# EAGLE design Power_Block (EAGLE 5.06)
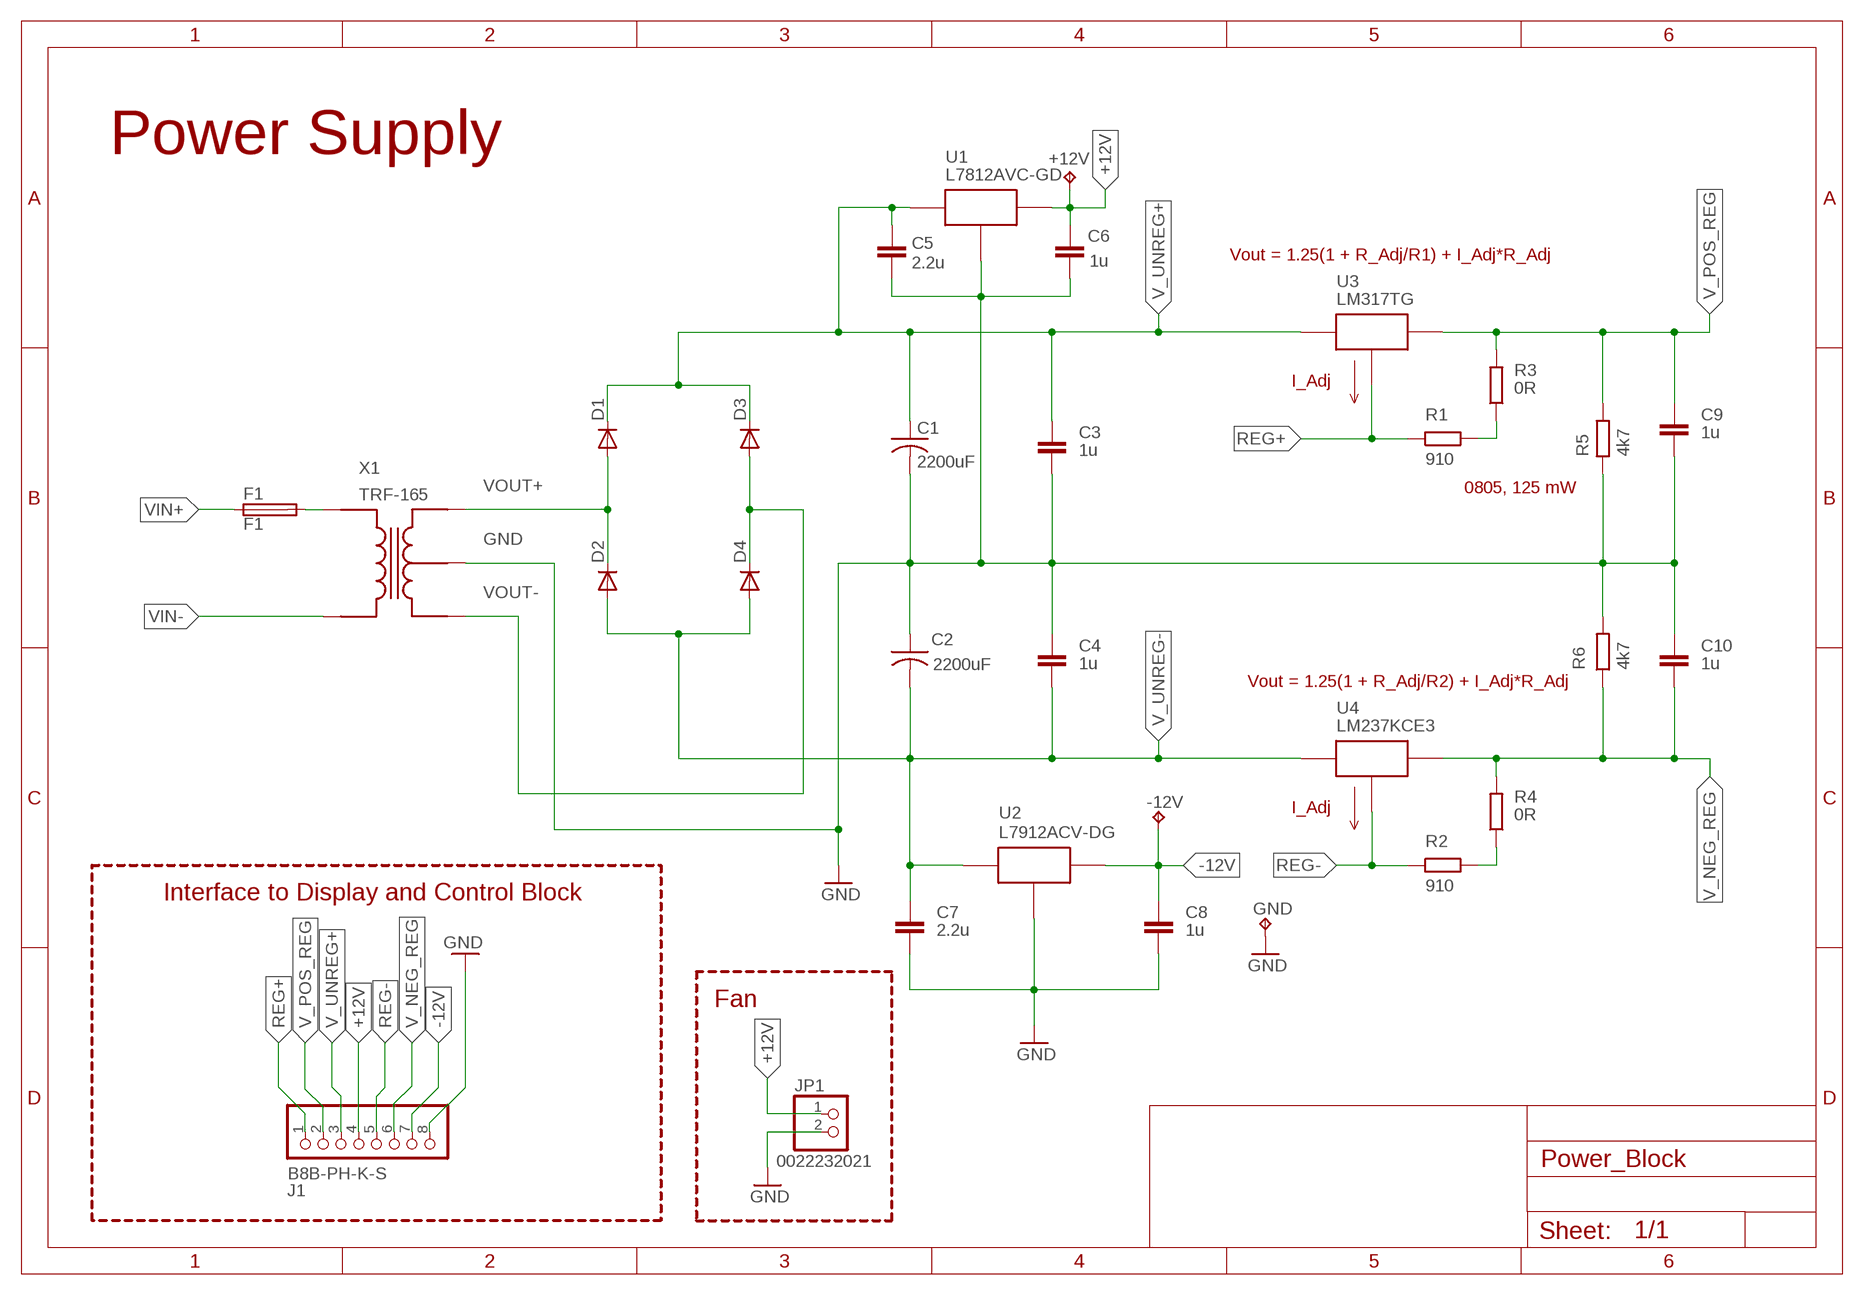
[diagram p0: schematic, sheet 1]

## Parts
+12V  TPTP20SQ  [TP20SQ]
-12V  TPTP20SQ  [TP20SQ]
C1  2200uF  ESK228M  [ESK228M]
C2  2200uF  ESK228M  [ESK228M]
C3  1u  C-EU025-024X044  [C025-024X044]
C4  1u  C-EU025-024X044  [C025-024X044]
C5  2.2u  C-EU025-024X044  [C025-024X044]
C6  1u  C-EU025-024X044  [C025-024X044]
C7  2.2u  C-EU025-024X044  [C025-024X044]
C8  1u  C-EU025-024X044  [C025-024X044]
C9  1u  C-EU025-024X044  [C025-024X044]
C10  1u  C-EU025-024X044  [C025-024X044]
D1  VS-2EFH02HM3/I  [DO-219AB]
D2  VS-2EFH02HM3/I  [DO-219AB]
D3  VS-2EFH02HM3/I  [DO-219AB]
D4  VS-2EFH02HM3/I  [DO-219AB]
F1  F1  SH22,5  [SH22,5]
GND  TPTP20SQ  [TP20SQ]
J1  B8B-PH-K-S  [B8B-PH-K-S]
JP1  0022232021  PINHD-1X2  [1X02]
R1  910  R-EU_R0603  [R0603]
R2  910  R-EU_R0603  [R0603]
R3  0R  R-EU_R0603  [R0603]
R4  0R  R-EU_R0603  [R0603]
R5  4k7  R-EU_M0805  [M0805]
R6  4k7  R-EU_M0805  [M0805]
U1  L7812AVC-GD  [T0-220]
U2  L7912ACV-DG  [T0-220]
U3  LM317TG  [T0-220]
U4  LM237KCE3  [T0-220]
X1  TRF-165  [TRF-165]

## Nets
+12V: +12V.TP C6.2 J1.4 JP1.1 U1.P3
-12V: -12V.TP C8.2 J1.7 U2.P3
GND: C1.LL- C2.LL+ C3.1 C4.2 C5.1 C6.1 C7.1 C8.1 C9.1 C10.2 GND.TP J1.8 JP1.2 R5.1 R6.2 U1.P2 U2.P1 X1.GND
N$15: R2.2 R4.1
N$17: R1.2 R3.1
REG+: J1.1 R1.1 U3.P1
REG-: J1.5 R2.1 U4.P1
V_NEG_REG: C10.1 J1.6 R4.2 R6.1 U4.P3
V_POS_REG: C9.2 J1.2 R3.2 R5.2 U3.P2
V_UNREG+: C1.LL+ C3.2 C5.2 D1.C D3.C J1.3 U1.P1 U3.P3
V_UNREG-: C2.LL- C4.1 C7.2 D2.A D4.A U2.P2 U4.P2
VIN+: F1.1
VIN+_F1: F1.2 X1.VIN1
VIN-: X1.VIN2
VOUT+: D1.A D2.C X1.VOUT+
VOUT-: D3.A D4.C X1.VOUT-

## Notes on the sheet
- Power Supply
- Vout = 1.25(1 + R_Adj/R1) + I_Adj*R_Adj
- I_Adj
- 0805, 125 mW
- Vout = 1.25(1 + R_Adj/R2) + I_Adj*R_Adj
- I_Adj
- Interface to Display and Control Block
- Fan

## Library data of the parts
+12V -12V GND = testpad:TP: Test pad
C1 C2 = VladimirG:ESK228M
C3-C10 = rcl:C-EU: CAPACITOR, European symbol
D1-D4 = VladimirG:VS-2EFH02HM3/I
F1 = fuse:SH22,5: FUSE HOLDER grid 22,5 mm, OGN0031 8201, Schurter (Buerklin)
J1 = VladimirG:B8B-PH-K-S: CONN HEADER VERT 8POS 2MM
JP1 = pinhead:PINHD-1X2: PIN HEADER
R1-R4 = rcl:R-EU_: RESISTOR, European symbol
R5 R6 = resistor:R-EU_: RESISTOR, European symbol
U1 = VladimirG:L7812AVC-GD: IC REG LINEAR 12V 1.5A TO220AB
U2 = VladimirG:L7912ACV-DG
U3 = VladimirG:LM317TG
U4 = VladimirG:LM237KCE3
X1 = VladimirG:TRF-165

## Board
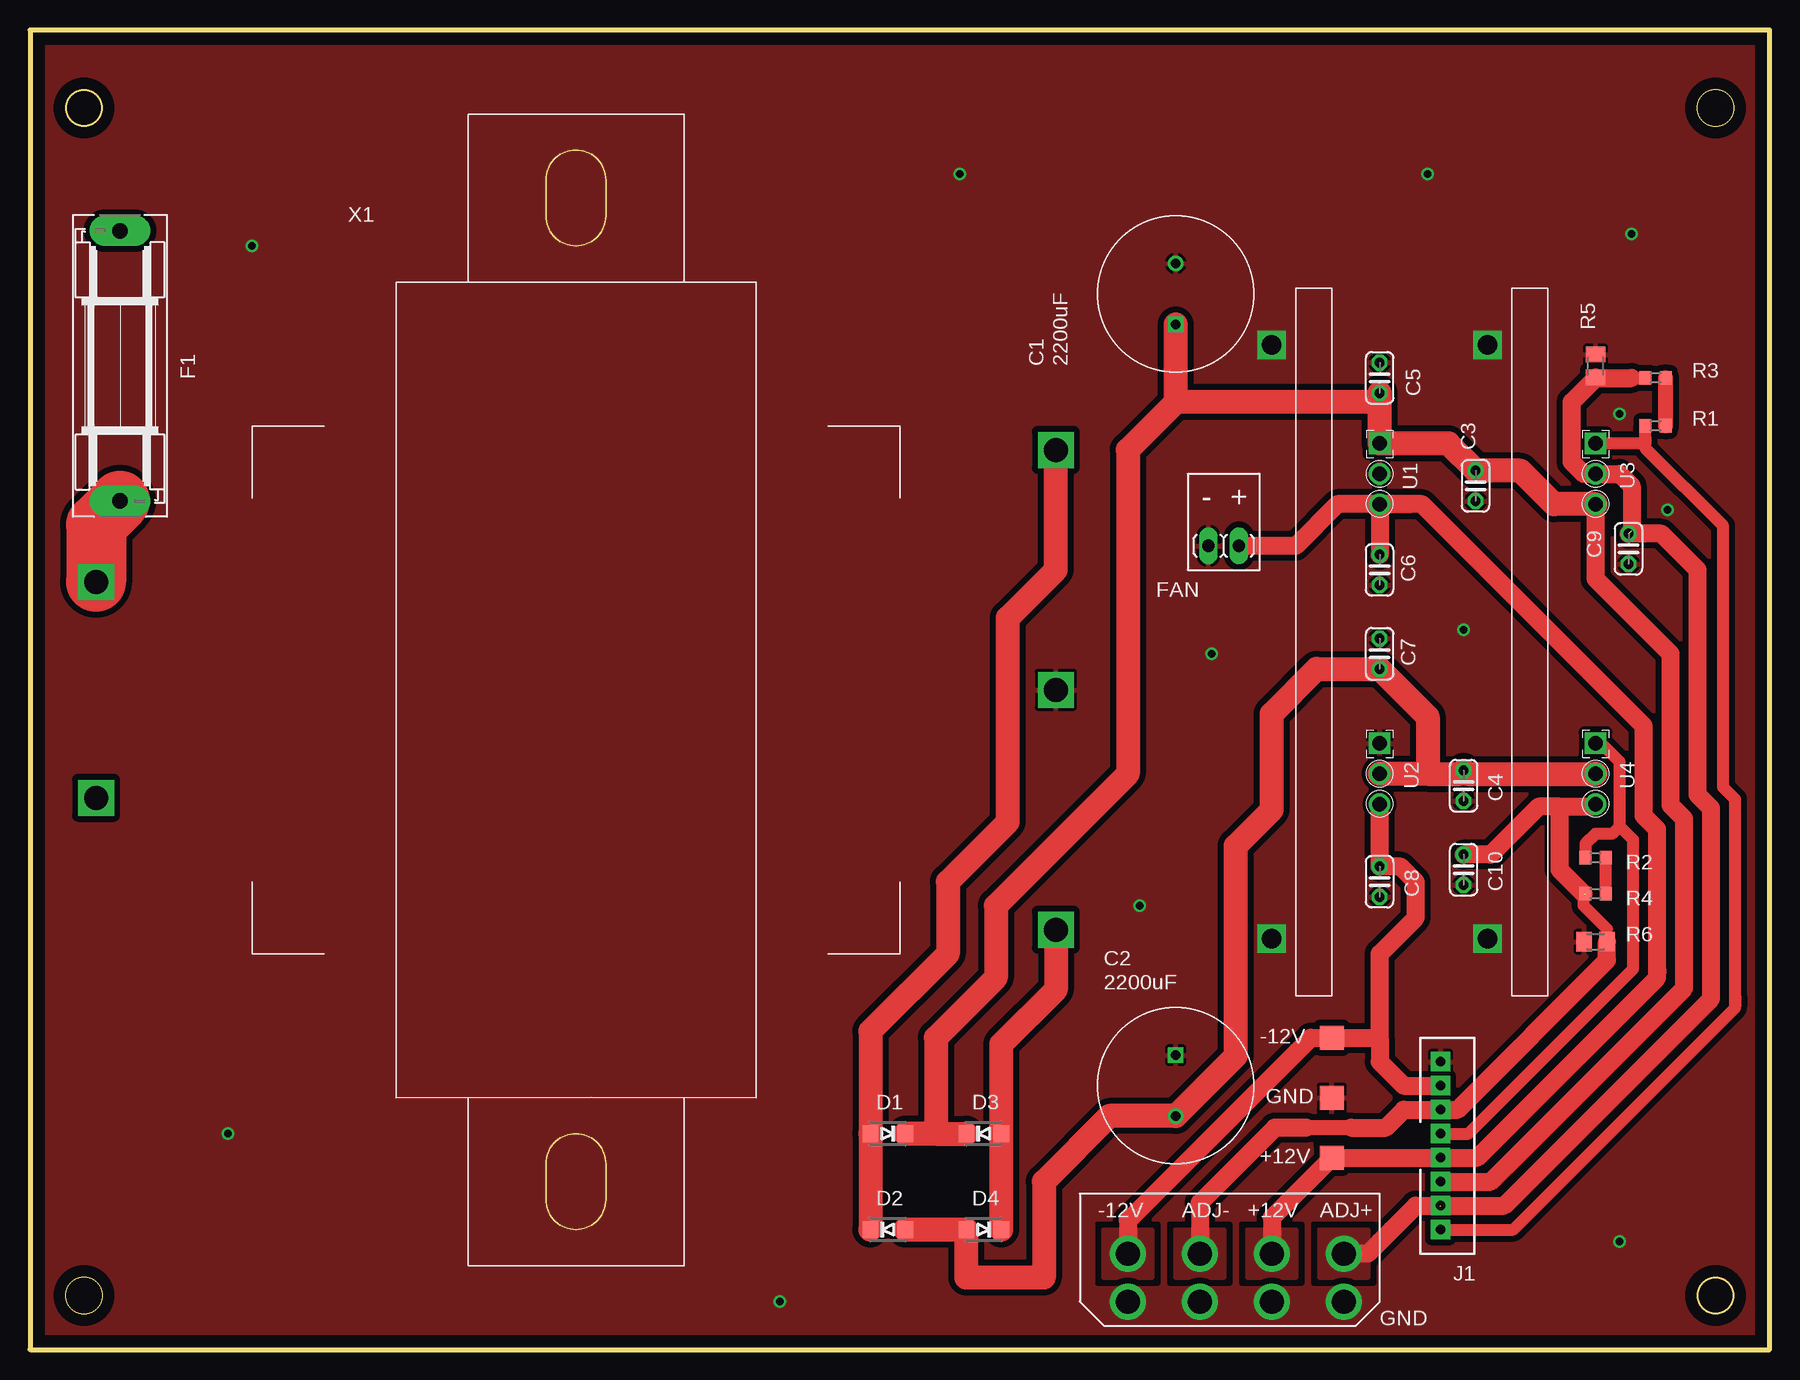
[diagram p1: board, top side]
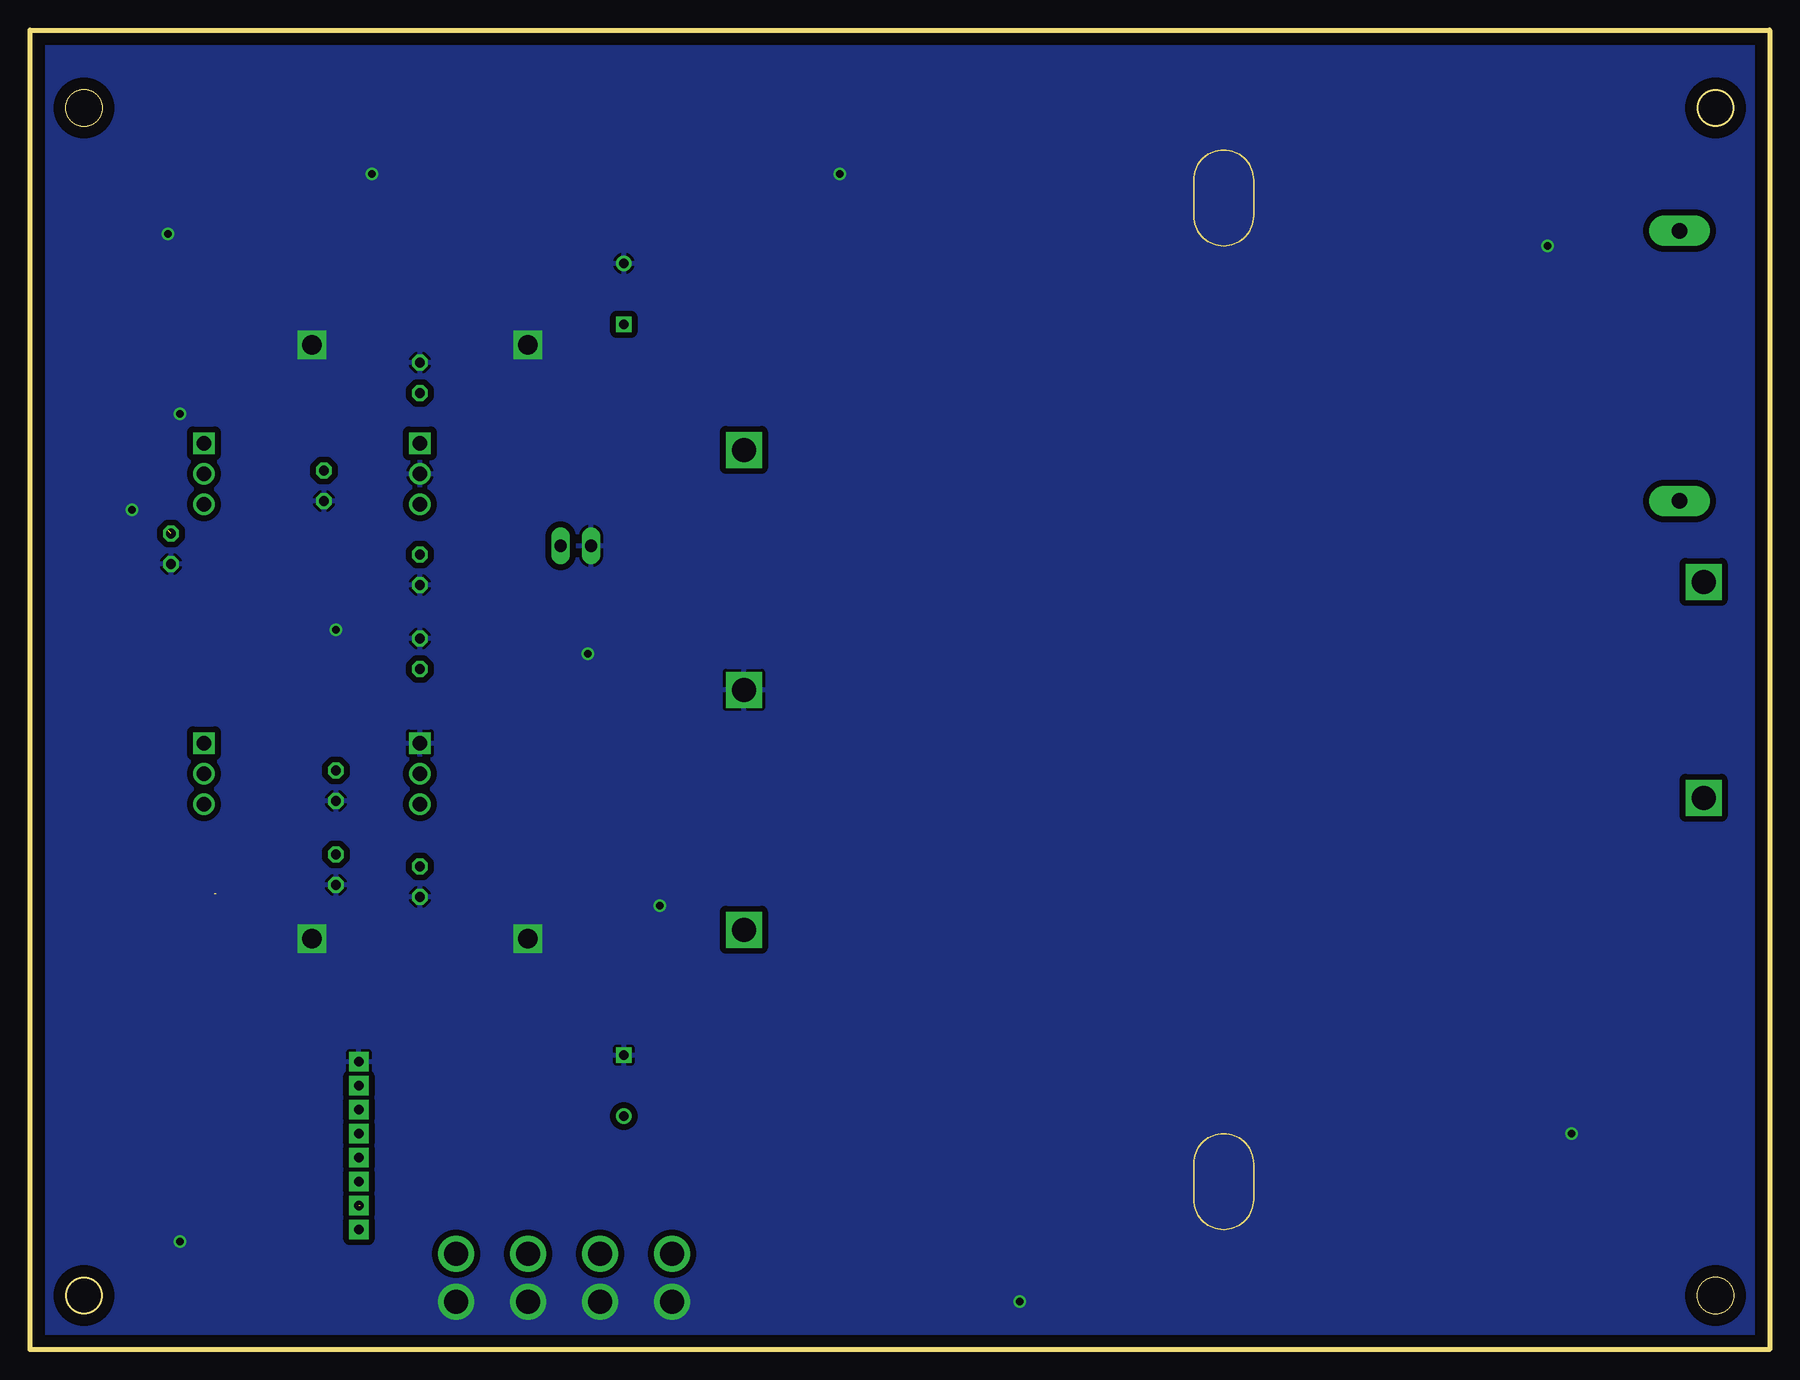
[diagram p2: board, bottom side, seen from below]

Size 145 x 110 mm. Coordinates in mm from the lower left corner, seen from the top.
Outline: 0,0 145,0 145,110 0,110 0,0
Copper layers (1*16): Top 0.035mm / dielectric 1.5mm / Bottom 0.035mm
Design rules "default *": minimum track width 10mil, minimum drill 24mil, track to track 0.5mm, track to pad 8mil, pad to pad 8mil, via to via 8mil, smd to smd 8mil, copper to edge 40mil, drill to drill 8mil, minimum pad ring 10mil, minimum via ring 8mil, stop-mask expansion 4mil, vias tented up to drill 0mil, thermal gap 10mil
Holes 3 mm at 4.5,103.5 140.5,103.5 140.5,4.5 4.5,4.5
Milling: area 139,102 to 142,105; area 3,102 to 6,105; area 3,3 to 6,6; area 139,3 to 142,6

### Footprints (pad centres in the part's own frame; a part is rotated, then mirrored left to right if it is on the bottom)
TP20SQ = smd 2 x 2: TP 0,0
ESK228M = drill 0.762 square: LL+ -2.54,0 | drill 0.762 round: LL- 2.54,0
C025-024X044 = drill 0.813 octagon: 1 -1.27,0; 2 1.27,0
DO-219AB = smd 1.295 x 1.397: A -1.448,0; C 1.448,0
SH22,5 = drill 1.321 pad 2.54 long: 1 -11.252,0; 2 11.252,0
B8B-PH-K-S = drill 0.8 pad 1.6 square: 1 -0.085,7; 2 -0.085,5; 3 -0.085,3; 4 -0.085,1; 5 -0.085,-1; 6 -0.085,-3; 7 -0.085,-5; 8 -0.085,-7
1X02 = drill 1.016 long: 1 -1.27,0; 2 1.27,0
R0603 = smd 1 x 1.1: 1 -0.85,0; 2 0.85,0
M0805 = smd 1.3 x 1.6: 1 -0.95,0; 2 0.95,0
T0-220 = drill 1.2 pad 1.7 square: P1 -2.54,0 | drill 1.2 pad 1.7 round: P2 0,0; P3 2.54,0
TRF-165 = drill 2 square: GND 40,0; VIN1 -40,9; VIN2 -40,-9; VOUT+ 40,20; VOUT- 40,-20

### Placement (x,y rotation side)
+12V  108.5,16 270 top
-12V  108.5,26 270 top
C1  95.5,88 90 top
C2  95.5,22 270 top
C3  120.5,72 90 top
C4  119.5,47 270 top
C5  112.5,81 270 top
C6  112.5,65 90 top
C7  112.5,58 270 top
C8  112.5,39 90 top
C9  133.25,66.75 90 top
C10  119.5,40 270 top
D1  71.5,18 0 top
D2  71.5,10 180 top
D3  79.5,18 180 top
D4  79.5,10 0 top
F1  7.5,82 270 top
GND  108.5,21 270 top
J1  117.5,17 180 top
JP1  99.5,67 180 top
R1  135.5,77 0 top
R2  130.5,41 0 top
R3  135.5,81 180 top
R4  130.5,38 180 top
R5  130.5,82 270 top
R6  130.5,34 180 top
U1  112.5,73 270 top
U2  112.5,48 270 top
U3  130.5,73 270 top
U4  130.5,48 270 top
X1  45.5,55 0 top

### Tracks (layer width: path | path; a pad name or v marks a point on that pad's centre or on a via)
+12V  (via drill 2 pad 0.71)
  Top 1.5: U1.P3 C6.2 | U1.P3 115.04,70.46 | U1.P3 116.04,70.46 134.5,52 134.5,44.5 135.62,43.38 135.62,31.75 | v103.5,8 103.5,11 +12V.TP J1.4 120.62,16 135.62,31 135.62,31.75 | JP1.1 105.5,67 108.96,70.46 U1.P3 | 135.62,31.75 135.62,31.38
  pour Top (isolate 0.25, no thermals): 101.5,10 105.5,10 105.5,6 101.5,6
-12V  (via drill 2 pad 0.71)
  Top 1.5: U2.P3 C8.2 114.23,40.27 115.5,39 115.5,36 112.5,33 112.5,26 | 112.5,26 112.5,24 114.5,22 J1.7 | 112.5,26 -12V.TP 106.75,26 105.62,24.88 | 105.62,24.88 106.12,25.38 | 105.62,24.88 91.5,10.75 v91.5,8
  pour Top (isolate 0.25, no thermals): 89.5,10 93.5,10 93.5,6 89.5,6
GND  (via drill 0.61 pad 0.71, 1.6 pad 0.71, 2 pad 0.71)
  other vias: 103.5,34.25 103.5,83.75 121.5,34.25 121.5,83.75 91.5,4 97.5,4 103.5,4 109.5,4 136.5,70 133.5,93 119.5,60 98.5,58 116.5,98 77.5,98 92.5,37 132.5,9 62.5,4 16.5,18 18.5,92 132.5,78
  pour Top (rank 2): -1,-1 -1,111 146,111 146,-1
  pour Bottom: -2,-2 -2,112 147,112 147,-2
N$15
  Top 1: R4.1 R2.2
N$17
  Top 1.25: R1.2 R3.1
REG+
  Top 1: 134.65,76 134.65,75.54 U3.P1 | 134.65,76 R1.1 | 142.12,29.5 142.12,28.62 | 142.12,29.5 142.12,45.88 141.12,46.88 141.12,68.65 134.65,75.12 134.65,76 | J1.1 123.62,10 142.12,28.5 142.12,29.5
REG-
  Top 1: R2.1 129.65,42.15 130.5,43 131.88,43 132.5,43.62 | 132.5,43.62 133.62,42.5 133.62,31.75 119.88,18 J1.5 | 132.5,43.62 132.5,49 130.96,50.54 U4.P1
V_NEG_REG  (via drill 2 pad 0.71)  (1 unrouted)
  Top 1: 130.31,45.27 U4.P3 | 129.5,38 129.5,37 131.45,35.05 R6.1
  Top 1.25: 110.12,18.5 106.38,18.5
  Top 1.5: 127.5,45.27 130.31,45.27 | 127.5,45.27 125.77,45.27 121.77,41.27 C10.1 | 127.5,45.27 127.5,40 129.5,38 | v97.5,8 97.5,12.25 103.75,18.5 106.38,18.5 | 110.12,18.5 113,18.5 114.5,20 J1.6 119,20 131.45,32.45 R6.1
  pour Top (isolate 0.25, no thermals): 95.5,10 99.5,10 99.5,6 95.5,6
V_POS_REG  (via drill 2 pad 0.71)  (2 unrouted)
  Top 1: 133.5,81 R3.2
  Top 1.5: 133.5,68.27 133.5,72 132.5,73 U3.P2 129.5,73 128.5,74 128.5,79 130.5,81 R5.2 130.55,81 133.5,81 | 117.5,12 115.5,12 113.5,10 | 113.5,10 112.5,9 | v109.5,8 111.5,8 113.5,10 | J1.2 122.88,12 140.12,29.25 140.12,45.12 139,46.25 139,65 135.98,68.02 C9.2
  pour Top (isolate 0.25, no thermals): 107.5,10 111.5,10 111.5,6 107.5,6
V_UNREG+
  Top 1: U3.P3 130.31,70.27
  Top 1.5: 137.88,43 137.88,43.38 | 137.88,43 137.88,44.25 136.75,45.38 136.75,58 130.5,64.25 U3.P3 | J1.3 121.75,14 137.88,30.12 137.88,43
  Top 2: 75.5,18 D3.C | 75.5,18 D1.C | U3.P3 127.04,70.46 124.23,73.27 C3.2 118.23,75.54 U1.P1 C5.2 arc-90 111.77,79 95.5,79 | 75.5,18 75.5,26 80.5,31 80.5,37 91.5,48 91.5,75 95.5,79 | 95.5,79 C1.LL+
V_UNREG-
  Top 2: D2.A D4.A 78.05,6 84.5,6 84.5,14 89.96,19.46 C2.LL- 100.5,24.46 100.5,42 103.5,45 103.5,53 107.23,56.73 C7.2 116.5,52.73 116.5,48 | 116.5,48 U2.P2 | 116.5,48 119.23,48 C4.1 119.77,48 U4.P2
VIN+_F1
  Top 5: X1.VIN1 5.5,68.75 F1.2
VOUT+
  Top 2: X1.VOUT+ 85.5,65 81.5,61 81.5,44 76.5,39 76.5,33 70.05,26.55 D1.A D2.C
VOUT-
  Top 2: D4.C D3.A 80.95,25.45 85.5,30 X1.VOUT-

### Text on the board
tPlace: - | + | FAN | -12V | ADJ- | +12V | ADJ+ | GND